# Altium project scope_pcb.PrjPcb
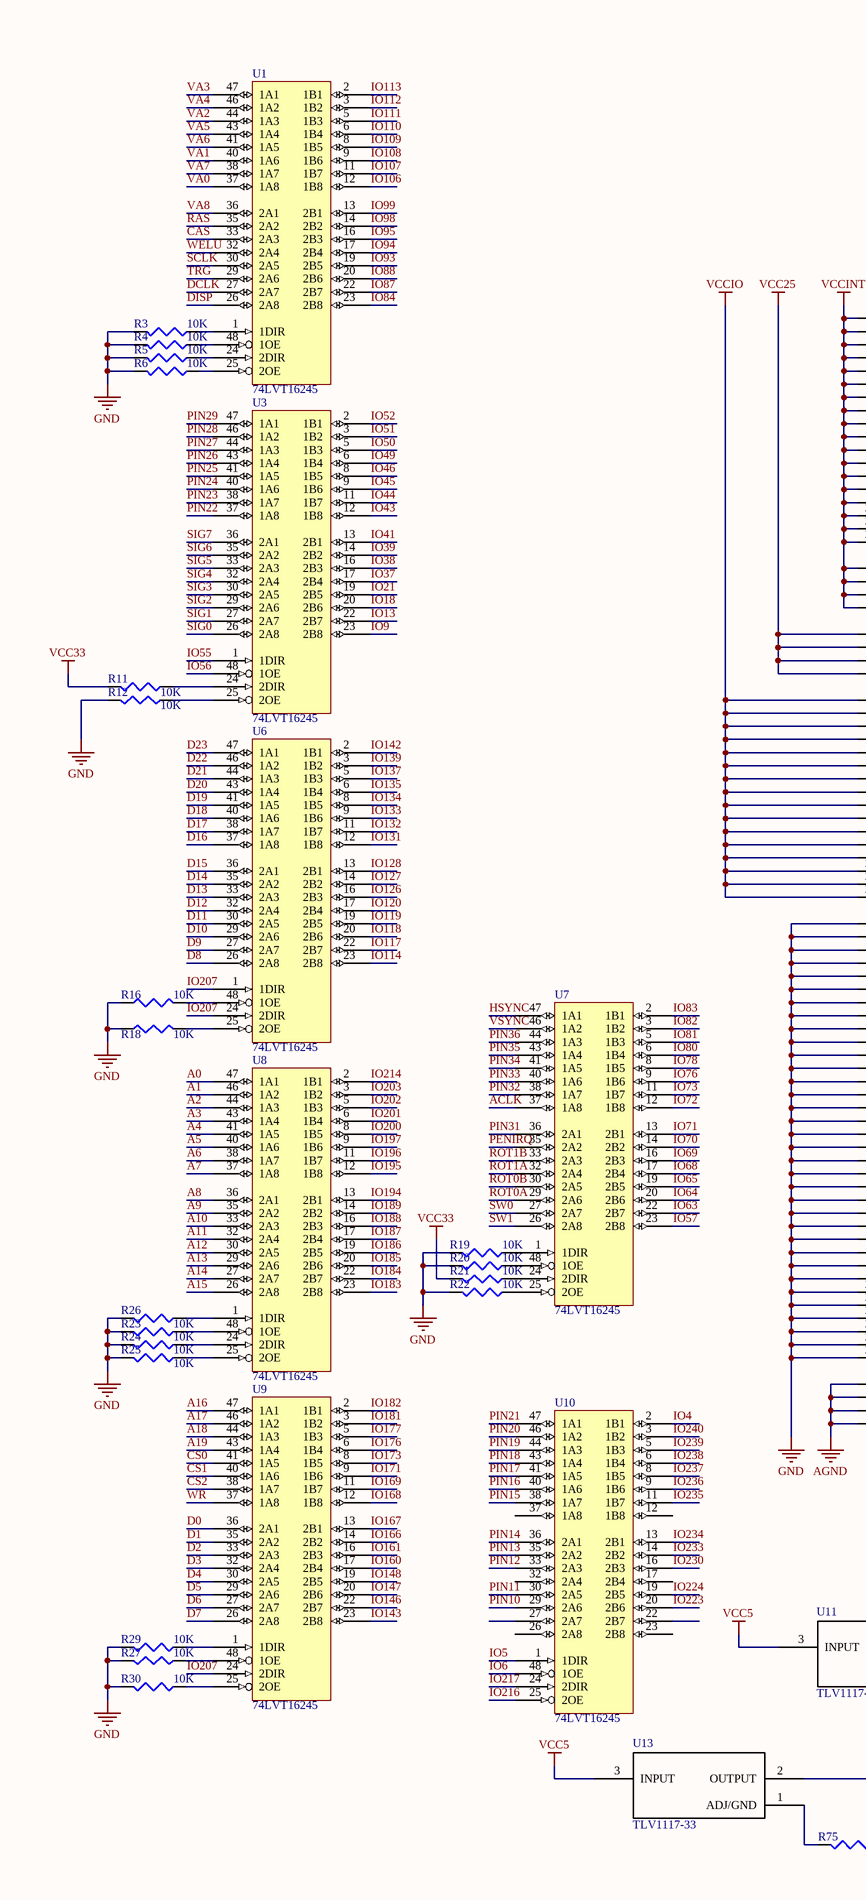
[diagram p0: fpga_sch.SchDoc, left]
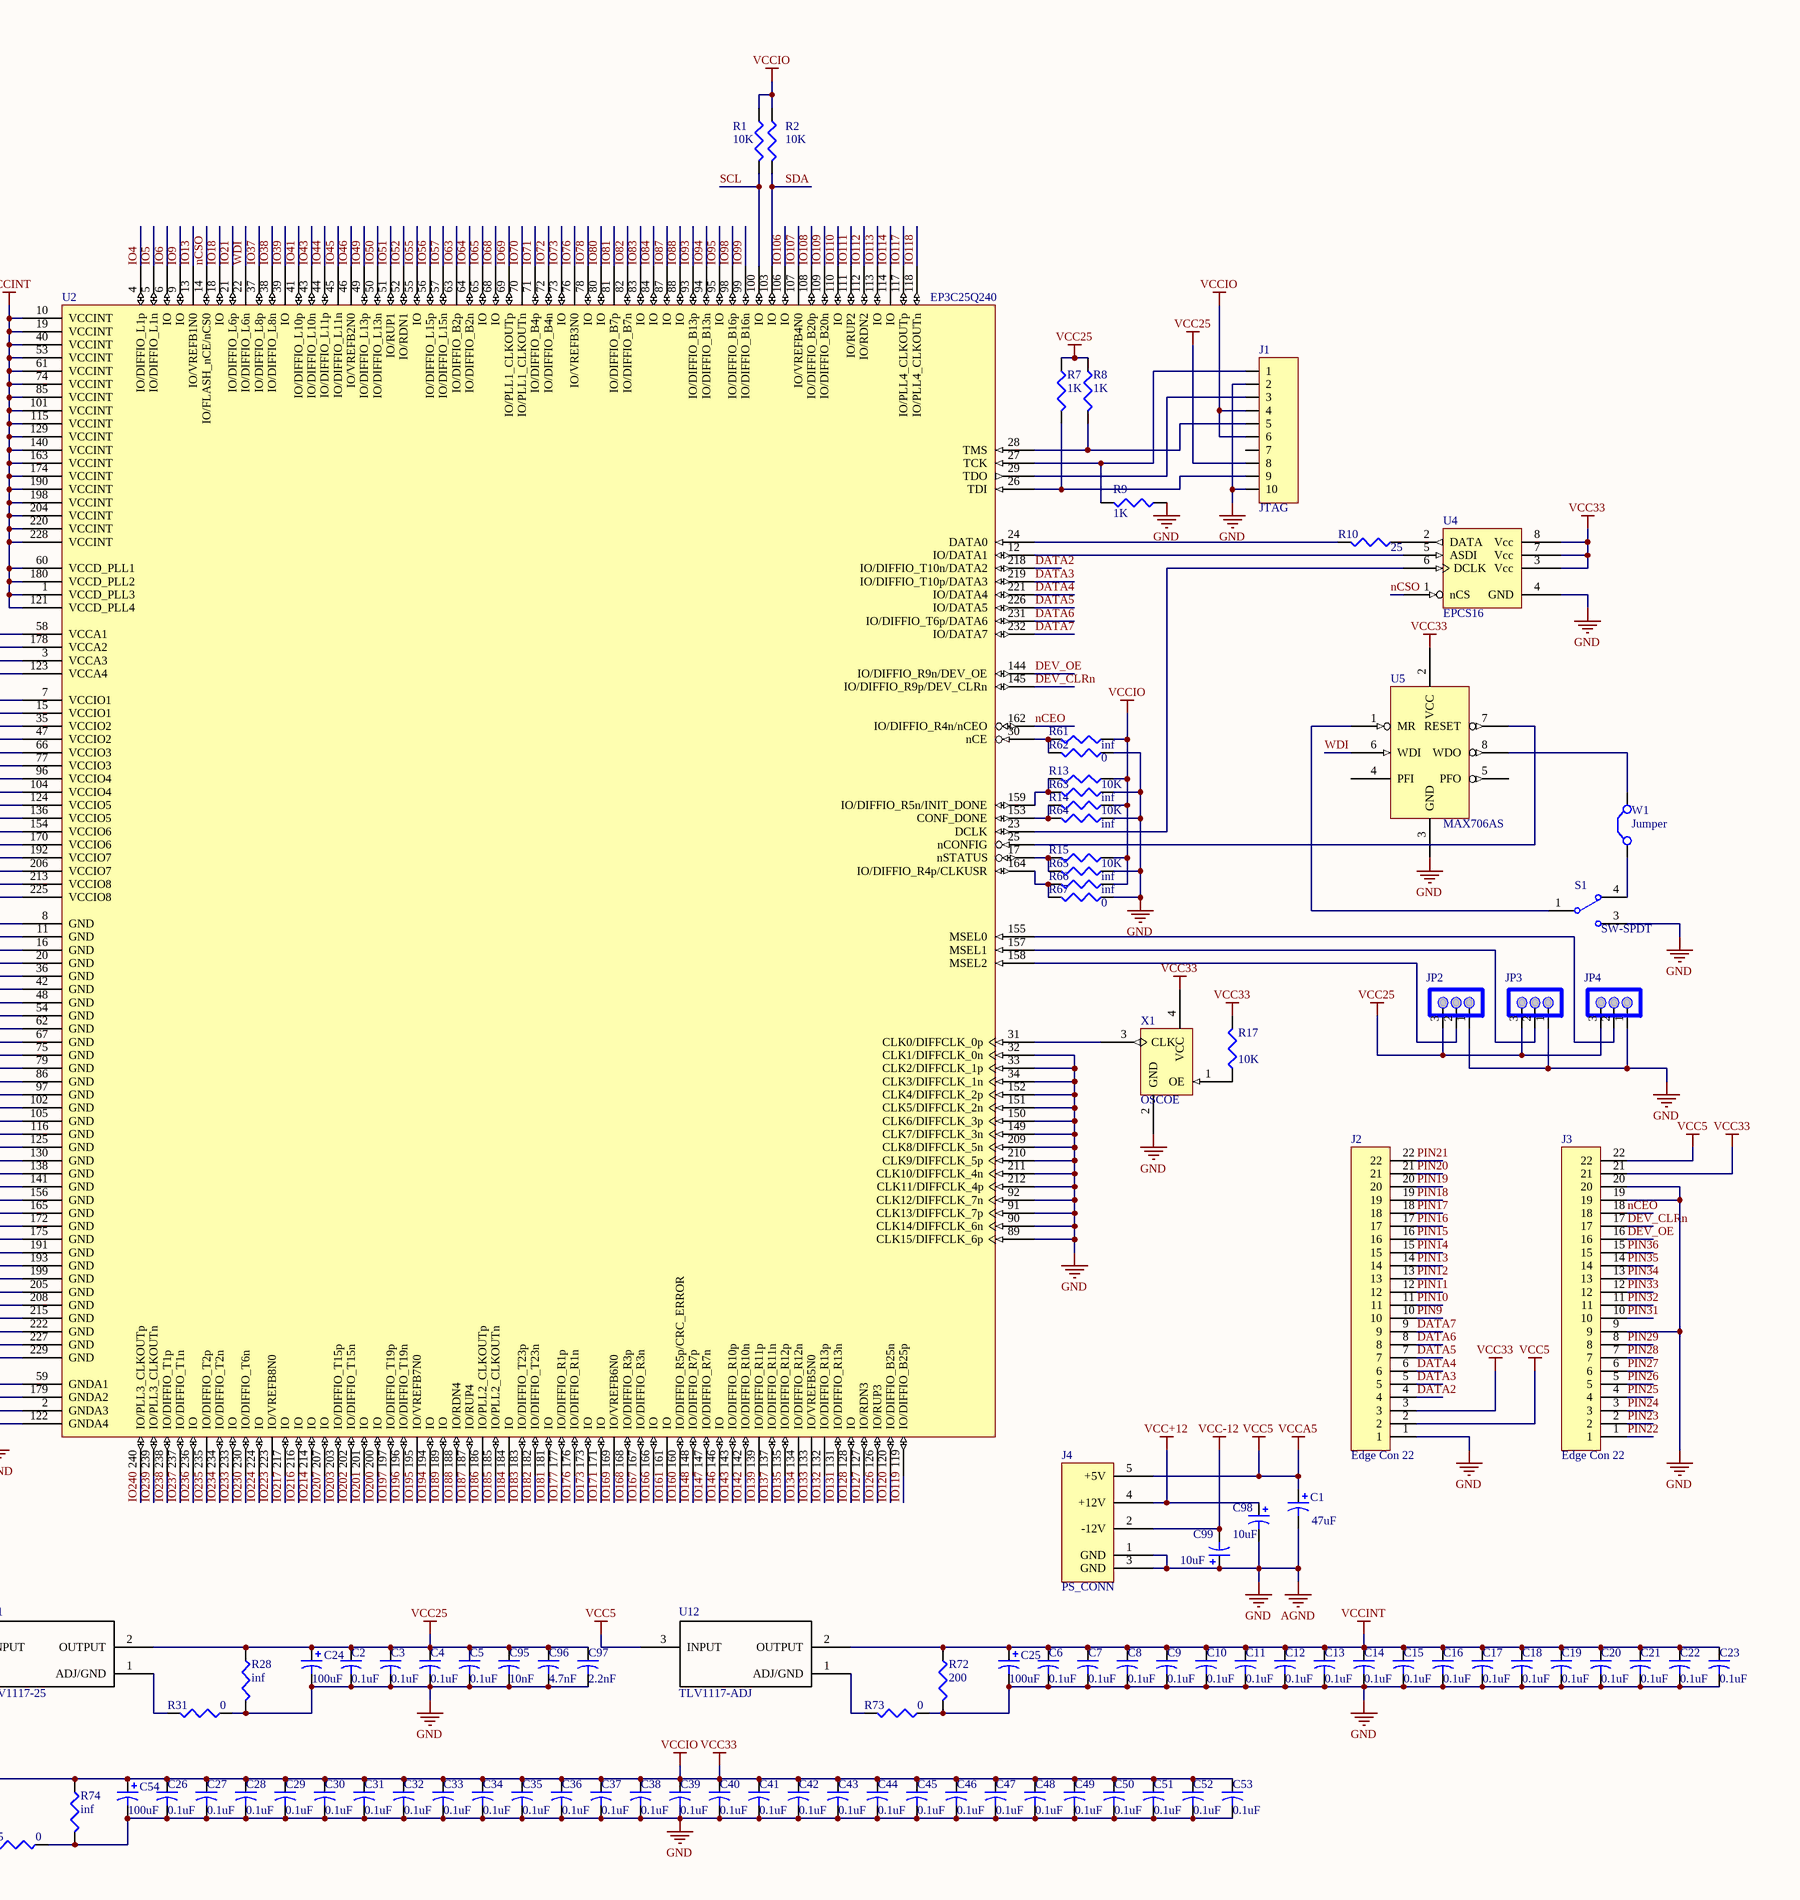
[diagram p1: fpga_sch.SchDoc, right]
5 sheets, 218 parts. Net scope: global (net labels, ports and power ports of the same name join across sheets).
Board file: SCOPE.PcbDoc
Sheets:
  fpga_sch.SchDoc
  sram_rom.SchDoc
  analog_frontend.SchDoc
  user_input.SchDoc
  vram.SchDoc

## Sheet fpga_sch.SchDoc: SoPC Oscilloscope - FPGA, Buffers
size C; Author: Santiago Navonne; DrawnBy: Santiago Navonne; Revision: 1.1; SheetNumber: 1; SheetTotal: 5

### Parts
C1  value 47uF  [CAPC3216N]  (hidden comment: Cap Pol1)
C2  value 0.1uF  [CAPC1608L]  (hidden comment: Cap2)
C3  value 0.1uF  [CAPC1608L]  (hidden comment: Cap2)
C4  value 0.1uF  [CAPC1608L]  (hidden comment: Cap2)
C5  value 0.1uF  [CAPC1608L]  (hidden comment: Cap2)
C6  value 0.1uF  [CAPC1608L]  (hidden comment: Cap2)
C7  value 0.1uF  [CAPC1608L]  (hidden comment: Cap2)
C8  value 0.1uF  [CAPC1608L]  (hidden comment: Cap2)
C9  value 0.1uF  [CAPC1608L]  (hidden comment: Cap2)
C10  value 0.1uF  [CAPC1608L]  (hidden comment: Cap2)
C11  value 0.1uF  [CAPC1608L]  (hidden comment: Cap2)
C12  value 0.1uF  [CAPC1608L]  (hidden comment: Cap2)
C13  value 0.1uF  [CAPC1608L]  (hidden comment: Cap2)
C14  value 0.1uF  [CAPC1608L]  (hidden comment: Cap2)
C15  value 0.1uF  [CAPC1608L]  (hidden comment: Cap2)
C16  value 0.1uF  [CAPC1608L]  (hidden comment: Cap2)
C17  value 0.1uF  [CAPC1608L]  (hidden comment: Cap2)
C18  value 0.1uF  [CAPC1608L]  (hidden comment: Cap2)
C19  value 0.1uF  [CAPC1608L]  (hidden comment: Cap2)
C20  value 0.1uF  [CAPC1608L]  (hidden comment: Cap2)
C21  value 0.1uF  [CAPC1608L]  (hidden comment: Cap2)
C22  value 0.1uF  [CAPC1608L]  (hidden comment: Cap2)
C23  value 0.1uF  [CAPC1608L]  (hidden comment: Cap2)
C24  value 100uF  [C2917]  (hidden comment: Cap Pol3)
C25  value 100uF  [C2917]  (hidden comment: Cap Pol3)
C26  value 0.1uF  [CAPC1608L]  (hidden comment: Cap2)
C27  value 0.1uF  [CAPC1608L]  (hidden comment: Cap2)
C28  value 0.1uF  [CAPC1608L]  (hidden comment: Cap2)
C29  value 0.1uF  [CAPC1608L]  (hidden comment: Cap2)
C30  value 0.1uF  [CAPC1608L]  (hidden comment: Cap2)
C31  value 0.1uF  [CAPC1608L]  (hidden comment: Cap2)
C32  value 0.1uF  [CAPC1608L]  (hidden comment: Cap2)
C33  value 0.1uF  [CAPC1608L]  (hidden comment: Cap2)
C34  value 0.1uF  [CAPC1608L]  (hidden comment: Cap2)
C35  value 0.1uF  [CAPC1608L]  (hidden comment: Cap2)
C36  value 0.1uF  [CAPC1608L]  (hidden comment: Cap2)
C37  value 0.1uF  [CAPC1608L]  (hidden comment: Cap2)
C38  value 0.1uF  [CAPC1608L]  (hidden comment: Cap2)
C39  value 0.1uF  [CAPC1608L]  (hidden comment: Cap2)
C40  value 0.1uF  [CAPC1608L]  (hidden comment: Cap2)
C41  value 0.1uF  [CAPC1608L]  (hidden comment: Cap2)
C42  value 0.1uF  [CAPC1608L]  (hidden comment: Cap2)
C43  value 0.1uF  [CAPC1608L]  (hidden comment: Cap2)
C44  value 0.1uF  [CAPC1608L]  (hidden comment: Cap2)
C45  value 0.1uF  [CAPC1608L]  (hidden comment: Cap2)
C46  value 0.1uF  [CAPC1608L]  (hidden comment: Cap2)
C47  value 0.1uF  [CAPC1608L]  (hidden comment: Cap2)
C48  value 0.1uF  [CAPC1608L]  (hidden comment: Cap2)
C49  value 0.1uF  [CAPC1608L]  (hidden comment: Cap2)
C50  value 0.1uF  [CAPC1608L]  (hidden comment: Cap2)
C51  value 0.1uF  [CAPC1608L]  (hidden comment: Cap2)
C52  value 0.1uF  [CAPC1608L]  (hidden comment: Cap2)
C53  value 0.1uF  [CAPC1608L]  (hidden comment: Cap2)
C54  value 100uF  [C2917]  (hidden comment: Cap Pol3)
C95  value 10nF  [CAPC1608L]  (hidden comment: Cap2)
C96  value 4.7nF  [CAPC1608L]  (hidden comment: Cap2)
C97  value 2.2nF  [CAPC1608L]  (hidden comment: Cap2)
C98  value 10uF  [CAPC3216N]  (hidden comment: Cap Pol1)
C99  value 10uF  [CAPC3216N]  (hidden comment: Cap Pol1)
J1  JTAG  [SIP2X5]
J2  Edge Con 22  [PIN22]
J3  Edge Con 22  [PIN22]
J4  PS_CONN  [DIN5]
JP2  MSEL2  [HDR1X3]  (value not drawn)
JP3  MSEL1  [HDR1X3]  (value not drawn)
JP4  MSEL0  [HDR1X3]  (value not drawn)
R1  value 10K  [RESC1608N]  (hidden comment: Res3)
R2  value 10K  [RESC1608N]  (hidden comment: Res3)
R3  value 10K  [RESC1608N]  (hidden comment: Res3)
R4  value 10K  [RESC1608N]  (hidden comment: Res3)
R5  value 10K  [RESC1608N]  (hidden comment: Res3)
R6  value 10K  [RESC1608N]  (hidden comment: Res3)
R7  value 1K  [RESC1608N]  (hidden comment: Res3)
R8  value 1K  [RESC1608N]  (hidden comment: Res3)
R9  value 1K  [RESC1608N]  (hidden comment: Res3)
R10  value 25  [RESC1608N]  (hidden comment: Res3)
R11  value 10K  [RESC1608N]  (hidden comment: Res3)
R12  value 10K  [RESC1608N]  (hidden comment: Res3)
R13  value 10K  [RESC1608N]  (hidden comment: Res3)
R14  value 10K  [RESC1608N]  (hidden comment: Res3)
R15  value 10K  [RESC1608N]  (hidden comment: Res3)
R16  value 10K  [RESC1608N]  (hidden comment: Res3)
R17  value 10K  [RESC1608N]  (hidden comment: Res3)
R18  value 10K  [RESC1608N]  (hidden comment: Res3)
R19  value 10K  [RESC1608N]  (hidden comment: Res3)
R20  value 10K  [RESC1608N]  (hidden comment: Res3)
R21  value 10K  [RESC1608N]  (hidden comment: Res3)
R22  value 10K  [RESC1608N]  (hidden comment: Res3)
R23  value 10K  [RESC1608N]  (hidden comment: Res3)
R24  value 10K  [RESC1608N]  (hidden comment: Res3)
R25  value 10K  [RESC1608N]  (hidden comment: Res3)
R26  value 10K  [RESC1608N]  (hidden comment: Res3)
R27  value 10K  [RESC1608N]  (hidden comment: Res3)
R28  value inf  [RESC1608N]  (hidden comment: Res3)
R29  value 10K  [RESC1608N]  (hidden comment: Res3)
R30  value 10K  [RESC1608N]  (hidden comment: Res3)
R31  value 0  [RESC1608N]  (hidden comment: Res3)
R61  value inf  [RESC1608N]  (hidden comment: Res3)
R62  value 0  [RESC1608N]  (hidden comment: Res3)
R63  value inf  [RESC1608N]  (hidden comment: Res3)
R64  value inf  [RESC1608N]  (hidden comment: Res3)
R65  value inf  [RESC1608N]  (hidden comment: Res3)
R66  value inf  [RESC1608N]  (hidden comment: Res3)
R67  value 0  [RESC1608N]  (hidden comment: Res3)
R72  value 200  [RESC1608N]  (hidden comment: Res3)
R73  value 0  [RESC1608N]  (hidden comment: Res3)
R74  value inf  [RESC1608N]  (hidden comment: Res3)
R75  value 0  [RESC1608N]  (hidden comment: Res3)
S1  SW-SPDT  [SPDT]
U1  74LVT16245  [TSSOP48]
U2  EP3C25Q240  [PQFP240]
U3  74LVT16245  [TSSOP48]
U4  EPCS16  [SO-8]
U5  MAX706AS  [DIP8]
U6  74LVT16245  [TSSOP48]
U7  74LVT16245  [TSSOP48]
U8  74LVT16245  [TSSOP48]
U9  74LVT16245  [TSSOP48]
U10  74LVT16245  [TSSOP48]
U11  TLV1117-25  [KVU3]
U12  TLV1117-ADJ  [KVU3]
U13  TLV1117-33  [KVU3]
W1  Jumper  [SIP2]
X1  OSCOE  [SG636PCE]

### Nets
AGND: C1.2 C2.2 C3.2 C4.2 C5.2 C6.2 C7.2 C8.2 C9.2 C10.2 C11.2 C12.2 C13.2 C14.2 C15.2 C16.2 C17.2 C18.2 C19.2 C20.2 C21.2 C22.2 C23.2 C24.2 C25.2 C26.2 C27.2 C28.2 C29.2 C30.2 C31.2 C32.2 C33.2 C34.2 C35.2 C36.2 C37.2 C38.2 C39.2 C40.2 C41.2 C42.2 C43.2 C44.2 C45.2 C46.2 C47.2 C48.2 C49.2 C50.2 C51.2 C52.2 C53.2 C54.2 C95.2 C96.2 C97.2 C98.2 C99.1 J1.2 J1.10 J2.1 J3.9 J3.19 J3.20 J4.1(GND) J4.3(GND) JP2.1(J1) JP3.1(J1) JP4.1(J1) R3.2 R4.2 R5.2 R6.2 R9.1 R12.2 R16.1 R18.1 R19.2 R20.2 R22.2 R23.2 R24.2 R25.2 R26.2 R27.2 R28.2 R29.2 R30.2 R31.1 R62.1 R63.1 R64.1 R65.1 R67.1 R72.2 R73.1 R74.2 R75.1 S1.3 U1.4(GND) U1.10(GND) U1.15(GND) U1.21(GND) U1.28(GND) U1.34(GND) U1.39(GND) U1.45(GND) U2.2(GNDA3) U2.8(GND) U2.11(GND) U2.16(GND) U2.20(GND) U2.32(CLK1/DIFFCLK_0n) U2.33(CLK2/DIFFCLK_1p) U2.34(CLK3/DIFFCLK_1n) U2.36(GND) U2.42(GND) U2.48(GND) U2.54(GND) U2.59(GNDA1) U2.62(GND) U2.67(GND) U2.75(GND) U2.79(GND) U2.86(GND) U2.89(CLK15/DIFFCLK_6p) U2.90(CLK14/DIFFCLK_6n) U2.91(CLK13/DIFFCLK_7p) U2.92(CLK12/DIFFCLK_7n) U2.97(GND) U2.102(GND) U2.105(GND) U2.116(GND) U2.122(GNDA4) U2.125(GND) U2.130(GND) U2.138(GND) U2.141(GND) U2.149(CLK7/DIFFCLK_3n) U2.150(CLK6/DIFFCLK_3p) U2.151(CLK5/DIFFCLK_2n) U2.152(CLK4/DIFFCLK_2p) U2.156(GND) U2.165(GND) U2.172(GND) U2.175(GND) U2.179(GNDA2) U2.191(GND) U2.193(GND) U2.199(GND) U2.205(GND) U2.208(GND) U2.209(CLK8/DIFFCLK_5n) U2.210(CLK9/DIFFCLK_5p) U2.211(CLK10/DIFFCLK_4n) U2.212(CLK11/DIFFCLK_4p) U2.215(GND) U2.222(GND) U2.227(GND) U2.229(GND) U3.4(GND) U3.10(GND) U3.15(GND) U3.21(GND) U3.28(GND) U3.34(GND) U3.39(GND) U3.45(GND) U4.4(GND) U5.3(GND) U6.4(GND) U6.10(GND) U6.15(GND) U6.21(GND) U6.28(GND) U6.34(GND) U6.39(GND) U6.45(GND) U7.4(GND) U7.10(GND) U7.15(GND) U7.21(GND) U7.28(GND) U7.34(GND) U7.39(GND) U7.45(GND) U8.4(GND) U8.10(GND) U8.15(GND) U8.21(GND) U8.28(GND) U8.34(GND) U8.39(GND) U8.45(GND) U9.4(GND) U9.10(GND) U9.15(GND) U9.21(GND) U9.28(GND) U9.34(GND) U9.39(GND) U9.45(GND) U10.4(GND) U10.10(GND) U10.15(GND) U10.21(GND) U10.28(GND) U10.34(GND) U10.39(GND) U10.45(GND) X1.2(GND)  [also labelled GND]
VCC: C1.1 C26.1 C27.1 C28.1 C29.1 C30.1 C31.1 C32.1 C33.1 C34.1 C35.1 C36.1 C37.1 C38.1 C39.1 C40.1 C41.1 C42.1 C43.1 C44.1 C45.1 C46.1 C47.1 C48.1 C49.1 C50.1 C51.1 C52.1 C53.1 C54.1 J1.4 J1.6 J2.2 J2.3 J3.21 J3.22 J4.5(+5V) R1.1 R2.1 R11.2 R13.1 R14.1 R15.1 R17.2 R21.2 R61.1 R66.1 R74.1 U1.7(Vcc33) U1.18(Vcc33) U1.31(Vcc33) U1.42(Vcc33) U2.7(VCCIO1) U2.15(VCCIO1) U2.35(VCCIO2) U2.47(VCCIO2) U2.66(VCCIO3) U2.77(VCCIO3) U2.96(VCCIO4) U2.104(VCCIO4) U2.124(VCCIO5) U2.136(VCCIO5) U2.154(VCCIO6) U2.170(VCCIO6) U2.192(VCCIO7) U2.206(VCCIO7) U2.213(VCCIO8) U2.225(VCCIO8) U3.7(Vcc33) U3.18(Vcc33) U3.31(Vcc33) U3.42(Vcc33) U4.3(Vcc) U4.7(Vcc) U4.8(Vcc) U5.2(VCC) U6.7(Vcc33) U6.18(Vcc33) U6.31(Vcc33) U6.42(Vcc33) U7.7(Vcc33) U7.18(Vcc33) U7.31(Vcc33) U7.42(Vcc33) U8.7(Vcc33) U8.18(Vcc33) U8.31(Vcc33) U8.42(Vcc33) U9.7(Vcc33) U9.18(Vcc33) U9.31(Vcc33) U9.42(Vcc33) U10.7(Vcc33) U10.18(Vcc33) U10.31(Vcc33) U10.42(Vcc33) U11.3(INPUT) U12.3(INPUT) U13.2(OUTPUT) U13.3(INPUT) X1.4(VCC)  [also labelled VCC33, VCC5, VCCA5, VCCIO]
VCC25: C2.1 C3.1 C4.1 C5.1 C24.1 C95.1 C96.1 C97.1 J1.8 JP2.3(J3) JP3.3(J3) JP4.3(J3) R7.1 R8.1 R28.1 U2.3(VCCA3) U2.58(VCCA1) U2.123(VCCA4) U2.178(VCCA2) U11.2(OUTPUT)
VCC+12: C98.1 J4.4(+12V)
VCC-12: C99.2 J4.2(-12V)
VCCINT: C6.1 C7.1 C8.1 C9.1 C10.1 C11.1 C12.1 C13.1 C14.1 C15.1 C16.1 C17.1 C18.1 C19.1 C20.1 C21.1 C22.1 C23.1 C25.1 R72.1 U2.1(VCCD_PLL3) U2.10(VCCINT) U2.19(VCCINT) U2.40(VCCINT) U2.53(VCCINT) U2.60(VCCD_PLL1) U2.61(VCCINT) U2.74(VCCINT) U2.85(VCCINT) U2.101(VCCINT) U2.115(VCCINT) U2.121(VCCD_PLL4) U2.129(VCCINT) U2.140(VCCINT) U2.163(VCCINT) U2.174(VCCINT) U2.180(VCCD_PLL2) U2.190(VCCINT) U2.198(VCCINT) U2.204(VCCINT) U2.220(VCCINT) U2.228(VCCINT) U12.2(OUTPUT)
A0: U8.47(1A1)
A1: U8.46(1A2)
A2: U8.44(1A3)
A3: U8.43(1A4)
A4: U8.41(1A5)
A5: U8.40(1A6)
A6: U8.38(1A7)
A7: U8.37(1A8)
A8: U8.36(2A1)
A9: U8.35(2A2)
A10: U8.33(2A3)
A11: U8.32(2A4)
A12: U8.30(2A5)
A13: U8.29(2A6)
A14: U8.27(2A7)
A15: U8.26(2A8)
A16: U9.47(1A1)
A17: U9.46(1A2)
A18: U9.44(1A3)
A19: U9.43(1A4)
ACLK: U7.37(1A8)
CAS: U1.33(2A3)
CS0: U9.41(1A5)
CS1: U9.40(1A6)
CS2: U9.38(1A7)
D0: U9.36(2A1)
D1: U9.35(2A2)
D2: U9.33(2A3)
D3: U9.32(2A4)
D4: U9.30(2A5)
D5: U9.29(2A6)
D6: U9.27(2A7)
D7: U9.26(2A8)
D8: U6.26(2A8)
D9: U6.27(2A7)
D10: U6.29(2A6)
D11: U6.30(2A5)
D12: U6.32(2A4)
D13: U6.33(2A3)
D14: U6.35(2A2)
D15: U6.36(2A1)
D16: U6.37(1A8)
D17: U6.38(1A7)
D18: U6.40(1A6)
D19: U6.41(1A5)
D20: U6.43(1A4)
D21: U6.44(1A3)
D22: U6.46(1A2)
D23: U6.47(1A1)
DATA2: J2.4 U2.218(IO/DIFFIO_T10n/DATA2)
DATA3: J2.5 U2.219(IO/DIFFIO_T10p/DATA3)
DATA4: J2.6 U2.221(IO/DATA4)
DATA5: J2.7 U2.226(IO/DATA5)
DATA6: J2.8 U2.231(IO/DIFFIO_T6p/DATA6)
DATA7: J2.9 U2.232(IO/DATA7)
DCLK: U1.27(2A7)
DEV_CLRn: J3.17 U2.145(IO/DIFFIO_R9p/DEV_CLRn)
DEV_OE: J3.16 U2.144(IO/DIFFIO_R9n/DEV_OE)
DISP: U1.26(2A8)
HSYNC: U7.47(1A1)
IO4: U2.4(IO/DIFFIO_L1p) U10.2(1B1)
IO5: U2.5(IO/DIFFIO_L1n) U10.1(1DIR)
IO6: U2.6(IO) U10.48(1OE)
IO9: U2.9(IO) U3.23(2B8)
IO13: U2.13(IO/VREFB1N0) U3.22(2B7)
IO18: U2.18(IO) U3.20(2B6)
IO21: U2.21(IO/DIFFIO_L6p) U3.19(2B5)
IO37: U2.37(IO/DIFFIO_L8p) U3.17(2B4)
IO38: U2.38(IO/DIFFIO_L8n) U3.16(2B3)
IO39: U2.39(IO) U3.14(2B2)
IO41: U2.41(IO/DIFFIO_L10p) U3.13(2B1)
IO43: U2.43(IO/DIFFIO_L10n) U3.12(1B8)
IO44: U2.44(IO/DIFFIO_L11p) U3.11(1B7)
IO45: U2.45(IO/DIFFIO_L11n) U3.9(1B6)
IO46: U2.46(IO/VREFB2N0) U3.8(1B5)
IO49: U2.49(IO/DIFFIO_L13p) U3.6(1B4)
IO50: U2.50(IO/DIFFIO_L13n) U3.5(1B3)
IO51: U2.51(IO/RUP1) U3.3(1B2)
IO52: U2.52(IO/RDN1) U3.2(1B1)
IO55: U2.55(IO) U3.1(1DIR)
IO56: U2.56(IO/DIFFIO_L15p) U3.48(1OE)
IO57: U2.57(IO/DIFFIO_L15n) U7.23(2B8)
IO63: U2.63(IO/DIFFIO_B2p) U7.22(2B7)
IO64: U2.64(IO/DIFFIO_B2n) U7.20(2B6)
IO65: U2.65(IO) U7.19(2B5)
IO68: U2.68(IO) U7.17(2B4)
IO69: U2.69(IO/PLL1_CLKOUTp) U7.16(2B3)
IO70: U2.70(IO/PLL1_CLKOUTn) U7.14(2B2)
IO71: U2.71(IO/DIFFIO_B4p) U7.13(2B1)
IO72: U2.72(IO/DIFFIO_B4n) U7.12(1B8)
IO73: U2.73(IO) U7.11(1B7)
IO76: U2.76(IO/VREFB3N0) U7.9(1B6)
IO78: U2.78(IO) U7.8(1B5)
IO80: U2.80(IO) U7.6(1B4)
IO81: U2.81(IO/DIFFIO_B7p) U7.5(1B3)
IO82: U2.82(IO/DIFFIO_B7n) U7.3(1B2)
IO83: U2.83(IO) U7.2(1B1)
IO84: U1.23(2B8) U2.84(IO)
IO87: U1.22(2B7) U2.87(IO)
IO88: U1.20(2B6) U2.88(IO)
IO93: U1.19(2B5) U2.93(IO/DIFFIO_B13p)
IO94: U1.17(2B4) U2.94(IO/DIFFIO_B13n)
IO95: U1.16(2B3) U2.95(IO)
IO98: U1.14(2B2) U2.98(IO/DIFFIO_B16p)
IO99: U1.13(2B1) U2.99(IO/DIFFIO_B16n)
IO106: U1.12(1B8) U2.106(IO)
IO107: U1.11(1B7) U2.107(IO/VREFB4N0)
IO108: U1.9(1B6) U2.108(IO/DIFFIO_B20p)
IO109: U1.8(1B5) U2.109(IO/DIFFIO_B20n)
IO110: U1.6(1B4) U2.110(IO)
IO111: U1.5(1B3) U2.111(IO/RUP2)
IO112: U1.3(1B2) U2.112(IO/RDN2)
IO113: U1.2(1B1) U2.113(IO)
IO114: U2.114(IO) U6.23(2B8)
IO117: U2.117(IO/PLL4_CLKOUTp) U6.22(2B7)
IO118: U2.118(IO/PLL4_CLKOUTn) U6.20(2B6)
IO119: U2.119(IO/DIFFIO_B25p) U6.19(2B5)
IO120: U2.120(IO/DIFFIO_B25n) U6.17(2B4)
IO126: U2.126(IO/RUP3) U6.16(2B3)
IO127: U2.127(IO/RDN3) U6.14(2B2)
IO128: U2.128(IO) U6.13(2B1)
IO131: U2.131(IO/DIFFIO_R13n) U6.12(1B8)
IO132: U2.132(IO/DIFFIO_R13p) U6.11(1B7)
IO133: U2.133(IO/VREFB5N0) U6.9(1B6)
IO134: U2.134(IO/DIFFIO_R12n) U6.8(1B5)
IO135: U2.135(IO/DIFFIO_R12p) U6.6(1B4)
IO137: U2.137(IO/DIFFIO_R11n) U6.5(1B3)
IO139: U2.139(IO/DIFFIO_R11p) U6.3(1B2)
IO142: U2.142(IO/DIFFIO_R10n) U6.2(1B1)
IO143: U2.143(IO/DIFFIO_R10p) U9.23(2B8)
IO146: U2.146(IO) U9.22(2B7)
IO147: U2.147(IO/DIFFIO_R7n) U9.20(2B6)
IO148: U2.148(IO/DIFFIO_R7p) U9.19(2B5)
IO160: U2.160(IO/DIFFIO_R5p/CRC_ERROR) U9.17(2B4)
IO161: U2.161(IO) U9.16(2B3)
IO166: U2.166(IO) U9.14(2B2)
IO167: U2.167(IO/DIFFIO_R3n) U9.13(2B1)
IO168: U2.168(IO/DIFFIO_R3p) U9.12(1B8)
IO169: U2.169(IO/VREFB6N0) U9.11(1B7)
IO171: U2.171(IO) U9.9(1B6)
IO173: U2.173(IO) U9.8(1B5)
IO176: U2.176(IO/DIFFIO_R1n) U9.6(1B4)
IO177: U2.177(IO/DIFFIO_R1p) U9.5(1B3)
IO181: U2.181(IO) U9.3(1B2)
IO182: U2.182(IO/DIFFIO_T23n) U9.2(1B1)
IO183: U2.183(IO/DIFFIO_T23p) U8.23(2B8)
IO184: U2.184(IO) U8.22(2B7)
IO185: U2.185(IO/PLL2_CLKOUTn) U8.20(2B6)
IO186: U2.186(IO/PLL2_CLKOUTp) U8.19(2B5)
IO187: U2.187(IO/RUP4) U8.17(2B4)
IO188: U2.188(IO/RDN4) U8.16(2B3)
IO189: U2.189(IO) U8.14(2B2)
IO194: U2.194(IO) U8.13(2B1)
IO195: U2.195(IO/VREFB7N0) U8.12(1B8)
IO196: U2.196(IO/DIFFIO_T19n) U8.11(1B7)
IO197: U2.197(IO/DIFFIO_T19p) U8.9(1B6)
IO200: U2.200(IO) U8.8(1B5)
IO201: U2.201(IO) U8.6(1B4)
IO202: U2.202(IO/DIFFIO_T15n) U8.5(1B3)
IO203: U2.203(IO/DIFFIO_T15p) U8.3(1B2)
IO207: U2.207(IO) U6.1(1DIR) U6.24(2DIR) U9.24(2DIR)
IO214: U2.214(IO) U8.2(1B1)
IO216: U2.216(IO) U10.25(2OE)
IO217: U2.217(IO) U10.24(2DIR)
IO223: U2.223(IO/VREFB8N0) U10.20(2B6)
IO224: U2.224(IO) U10.19(2B5)
IO230: U2.230(IO/DIFFIO_T6n) U10.16(2B3)
IO233: U2.233(IO) U10.14(2B2)
IO234: U2.234(IO/DIFFIO_T2n) U10.13(2B1)
IO235: U2.235(IO/DIFFIO_T2p) U10.11(1B7)
IO236: U2.236(IO) U10.9(1B6)
IO237: U2.237(IO/DIFFIO_T1n) U10.8(1B5)
IO238: U2.238(IO/DIFFIO_T1p) U10.6(1B4)
IO239: U2.239(IO/PLL3_CLKOUTn) U10.5(1B3)
IO240: U2.240(IO/PLL3_CLKOUTp) U10.3(1B2)
nCEO: J3.18 U2.162(IO/DIFFIO_R4n/nCEO)
nCSO: U2.14(IO/FLASH_nCE/nCS0) U4.1(nCS)
PENIRQ: U7.35(2A2)
PIN9: J2.10
PIN10: J2.11 U10.29(2A6)
PIN11: J2.12 U10.30(2A5)
PIN12: J2.13 U10.33(2A3)
PIN13: J2.14 U10.35(2A2)
PIN14: J2.15 U10.36(2A1)
PIN15: J2.16 U10.38(1A7)
PIN16: J2.17 U10.40(1A6)
PIN17: J2.18 U10.41(1A5)
PIN18: J2.19 U10.43(1A4)
PIN19: J2.20 U10.44(1A3)
PIN20: J2.21 U10.46(1A2)
PIN21: J2.22 U10.47(1A1)
PIN22: J3.1 U3.37(1A8)
PIN23: J3.2 U3.38(1A7)
PIN24: J3.3 U3.40(1A6)
PIN25: J3.4 U3.41(1A5)
PIN26: J3.5 U3.43(1A4)
PIN27: J3.6 U3.44(1A3)
PIN28: J3.7 U3.46(1A2)
PIN29: J3.8 U3.47(1A1)
PIN31: J3.10 U7.36(2A1)
PIN32: J3.11 U7.38(1A7)
PIN33: J3.12 U7.40(1A6)
PIN34: J3.13 U7.41(1A5)
PIN35: J3.14 U7.43(1A4)
PIN36: J3.15 U7.44(1A3)
RAS: U1.35(2A2)
ROT0A: U7.29(2A6)
ROT0B: U7.30(2A5)
ROT1A: U7.32(2A4)
ROT1B: U7.33(2A3)
SCL: R1.2 U2.100(IO)
SCLK: U1.30(2A5)
SDA: R2.2 U2.103(IO)
SIG0: U3.26(2A8)
SIG1: U3.27(2A7)
SIG2: U3.29(2A6)
SIG3: U3.30(2A5)
SIG4: U3.32(2A4)
SIG5: U3.33(2A3)
SIG6: U3.35(2A2)
SIG7: U3.36(2A1)
SW0: U7.27(2A7)
SW1: U7.26(2A8)
TRG: U1.29(2A6)
VA0: U1.37(1A8)
VA1: U1.40(1A6)
VA2: U1.44(1A3)
VA3: U1.47(1A1)
VA4: U1.46(1A2)
VA5: U1.43(1A4)
VA6: U1.41(1A5)
VA7: U1.38(1A7)
VA8: U1.36(2A1)
VSYNC: U7.46(1A2)
WDI: U2.22(IO/DIFFIO_L6n) U5.6(WDI)
WELU: U1.32(2A4)
WR: U9.37(1A8)
NetJ1_1: J1.1 R9.2 U2.27(TCK)
NetJ1_3: J1.3 U2.29(TDO)
NetJ1_5: J1.5 R8.2 U2.28(TMS)
NetJ1_9: J1.9 R7.2 U2.26(TDI)
NetJP2_2: JP2.2(J2) U2.158(MSEL2)
NetJP3_2: JP3.2(J2) U2.157(MSEL1)
NetJP4_2: JP4.2(J2) U2.155(MSEL0)
NetR3_1: R3.1 U1.1(1DIR)
NetR4_1: R4.1 U1.48(1OE)
NetR5_1: R5.1 U1.24(2DIR)
NetR6_1: R6.1 U1.25(2OE)
NetR10_1: R10.1 U4.2(DATA)
NetR10_2: R10.2 U2.24(DATA0)
NetR11_1: R11.1 U3.24(2DIR)
NetR12_1: R12.1 U3.25(2OE)
NetR13_2: R13.2 R63.2 U2.159(IO/DIFFIO_R5n/INIT_DONE)
NetR14_2: R14.2 R64.2 U2.153(CONF_DONE)
NetR15_2: R15.2 R65.2 U2.17(nSTATUS)
NetR16_2: R16.2 U6.48(1OE)
NetR17_1: R17.1 X1.1(OE)
NetR18_2: R18.2 U6.25(2OE)
NetR19_1: R19.1 U7.1(1DIR)
NetR20_1: R20.1 U7.48(1OE)
NetR21_1: R21.1 U7.24(2DIR)
NetR22_1: R22.1 U7.25(2OE)
NetR23_1: R23.1 U8.48(1OE)
NetR24_1: R24.1 U8.24(2DIR)
NetR25_1: R25.1 U8.25(2OE)
NetR26_1: R26.1 U8.1(1DIR)
NetR27_1: R27.1 U9.48(1OE)
NetR29_1: R29.1 U9.1(1DIR)
NetR30_1: R30.1 U9.25(2OE)
NetR31_2: R31.2 U11.1(ADJ/GND)
NetR61_2: R61.2 R62.2 U2.30(nCE)
NetR66_2: R66.2 R67.2 U2.164(IO/DIFFIO_R4p/CLKUSR)
NetR73_2: R73.2 U12.1(ADJ/GND)
NetR75_2: R75.2 U13.1(ADJ/GND)
NetS1_1: S1.1 U5.1(MR)
NetS1_4: S1.4 W1.1(C1)
NetU2_12: U2.12(IO/DATA1) U4.5(ASDI)
NetU2_23: U2.23(DCLK) U4.6(DCLK)
NetU2_25: U2.25(nCONFIG) U5.7(RESET)
NetU2_31: U2.31(CLK0/DIFFCLK_0p) X1.3(CLK)
NetU5_8: U5.8(WDO) W1.2(C2)

Not connected (* = marked no-connect by the designer): J1 7; U5 4(PFI) 5(PFO); U10 12(1B8) 17(2B4) 22(2B7) 23(2B8) 26(2A8) 27(2A7) 32(2A4) 37(1A8)

### Library data of the parts
C1 C98 C99 = Cap Pol1: Polarized Capacitor; Published: 8-Jun-2000; LatestRevisionDate: 17-Jul-2002; LatestRevisionNote: Re-released for DXP Platform.; PackageReference: RB7.6-15; Publisher: Altium Limited; PackageDescription: Polarized Capacitor (Radial); 2 Leads
C2-C23 C26-C53 C95-C97 = Cap2: Capacitor; Published: 23-Sep-2002; PackageReference: CAPR5-4X5; Publisher: Altium Limited; PackageDescription: Capacitor; 2 Leads
C24 C25 C54 = Cap Pol3: Polarized Capacitor (Surface Mount); Published: 8-Jun-2000; LatestRevisionDate: 29-May-2009; LatestRevisionNote: IPC-7351 Footprint Added.; PackageReference: C0805; Publisher: Altium Limited; PackageDescription: Chip Capacitor
J1 = CON10
J2 J3 = Edge Con 22: 22-Pin Edge Connector; LatestRevisionDate: 17-Jul-2002; LatestRevisionNote: Re-released for DXP Platform.; Publisher: Altium Limited
J4 = PS_CONN: Elpac Compatible Power Supply Connector
JP2-JP4 = JUMPER3SM
R1-R31 R61-R67 R72-R75 = Res3: Resistor; Published: 8-Jun-2000; LatestRevisionDate: 29-May-2009; LatestRevisionNote: IPC-7351 Footprint Added.; PackageReference: J1-0603; Publisher: Altium Limited; PackageDescription: Chip Resistor
S1 = SW-SPDT: SPDT Subminiature Toggle Switch, Right Angle Mounting, Vertical Actuation; Published: 24-Mar-1999; LatestRevisionDate: 17-Dec-2003; LatestRevisionNote: Schematic revised, PCB Footprint replaced.; PackageReference: TL36WW15050; Publisher: Altium Limited; PackageDescription: Switch; 4 Leads; DatasheetVersion: 05-Dec-2000; ComponentLink1Description: Manufacturer Link; ComponentLink1URL: http://www.apem.com
U1 U3 U6-U10 = 74LVT16245: 16-Bit Bus Transceiver
U2 = EP3C25Q240: Cyclone III EP3C-25 FPGA PQFP240
U4 = EPCS1: Altera Serial Configuration Device
U5 = MAX705: Maxim uP Supervisory Circuit
U11 = TLV1117-25_KVU_3: Imported; Vendor: Texas Instruments; PACKAGE_DESIGNATOR: KVU; PIN_COUNT: 3; FAMILY_NAME: STANDARD VOLTAGE REGULATOR; INDUSTRY_STD_PKG_TYPE: PFM; Manufacturer_Part_Number: tlv1117-25_kvu_3; GENERIC_PART_NUMBER: TLV1117-25; Datasheet URL: http://www.ti.com/lit/gpn/TLV1117-25; Manufacturer: Texas Instruments; RefDes: RefDes; Type: DEV; Value: Value
U12 = TLV1117_KCS_3: Imported; Vendor: Texas Instruments; PACKAGE_DESIGNATOR: KCS; PIN_COUNT: 3; FAMILY_NAME: STANDARD VOLTAGE REGULATOR; INDUSTRY_STD_PKG_TYPE: TO-220; Manufacturer_Part_Number: tlv1117_kcs_3; GENERIC_PART_NUMBER: TLV1117; Datasheet URL: http://www.ti.com/lit/gpn/TLV1117; Manufacturer: Texas Instruments; RefDes: RefDes; Type: DEV; Value: Value
U13 = TLV1117-33_KVU_3: Imported; Vendor: Texas Instruments; PACKAGE_DESIGNATOR: KVU; PIN_COUNT: 3; FAMILY_NAME: STANDARD VOLTAGE REGULATOR; INDUSTRY_STD_PKG_TYPE: PFM; Manufacturer_Part_Number: tlv1117-33_kvu_3; GENERIC_PART_NUMBER: TLV1117-33; Datasheet URL: http://www.ti.com/lit/gpn/TLV1117-33; Manufacturer: Texas Instruments; RefDes: RefDes; Type: DEV; Value: Value
W1 = Jumper: Jumper Wire; Published: 24-Mar-1999; LatestRevisionDate: 17-Jul-2002; LatestRevisionNote: Re-released for DXP Platform.; PackageReference: RAD-0.2; Publisher: Altium Limited; PackageDescription: Radial Cap, Thru-Hole; 2 Leads; 0.2 in Pin Spacing
X1 = OSCOE: Oscillator with Active High Output Enable

## Sheet sram_rom.SchDoc: SoPC Oscilloscope - SRAM, ROM
size A; DrawnBy: Santiago Navonne; Revision: 1.0; SheetNumber: 2; SheetTotal: 5
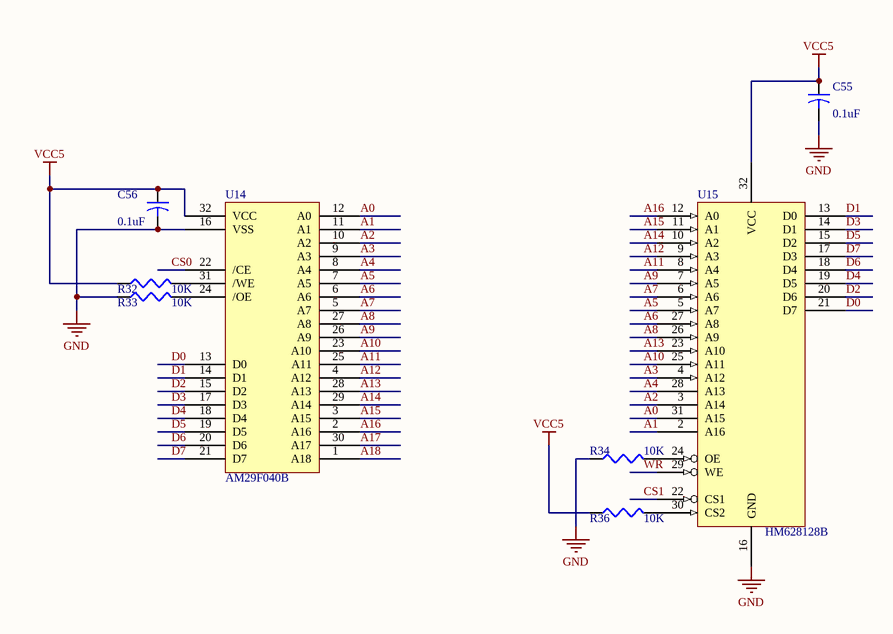
[diagram p2: sram_rom.SchDoc]

### Parts
C55  value 0.1uF  [CAPC1608L]  (hidden comment: Cap2)
C56  value 0.1uF  [CAPC1608L]  (hidden comment: Cap2)
R32  value 10K  [RESC1608N]  (hidden comment: Res3)
R33  value 10K  [RESC1608N]  (hidden comment: Res3)
R34  value 10K  [RESC1608N]  (hidden comment: Res3)
R36  value 10K  [RESC1608N]  (hidden comment: Res3)
U14  AM29F040B  [PLCCS32]
U15  HM628128B  [DIP32]

### Nets
GND: C55.2 C56.2 R33.1 R34.1 U14.16(VSS) U15.16(GND)  [project net AGND]
VCC: C55.1 C56.1 R32.1 R36.1 U14.32(VCC) U15.32(VCC)  [also labelled VCC5]
A0: U14.12(A0) U15.31(A15)
A1: U14.11(A1) U15.2(A16)
A2: U14.10(A2) U15.3(A14)
A3: U14.9(A3) U15.4(A12)
A4: U14.8(A4) U15.28(A13)
A5: U14.7(A5) U15.5(A7)
A6: U14.6(A6) U15.27(A8)
A7: U14.5(A7) U15.6(A6)
A8: U14.27(A8) U15.26(A9)
A9: U14.26(A9) U15.7(A5)
A10: U14.23(A10) U15.25(A11)
A11: U14.25(A11) U15.8(A4)
A12: U14.4(A12) U15.9(A3)
A13: U14.28(A13) U15.23(A10)
A14: U14.29(A14) U15.10(A2)
A15: U14.3(A15) U15.11(A1)
A16: U14.2(A16) U15.12(A0)
A17: U14.30(A17)
A18: U14.1(A18)
CS0: U14.22(/CE)
CS1: U15.22(CS1)
D0: U14.13(D0) U15.21(D7)
D1: U14.14(D1) U15.13(D0)
D2: U14.15(D2) U15.20(D6)
D3: U14.17(D3) U15.14(D1)
D4: U14.18(D4) U15.19(D5)
D5: U14.19(D5) U15.15(D2)
D6: U14.20(D6) U15.18(D4)
D7: U14.21(D7) U15.17(D3)
WR: U15.29(WE)
NetR32_2: R32.2 U14.31(/WE)
NetR33_2: R33.2 U14.24(/OE)
NetR34_2: R34.2 U15.24(OE)
NetR36_2: R36.2 U15.30(CS2)

### Library data of the parts
C55 C56 = Cap2: Capacitor; Published: 23-Sep-2002; PackageReference: CAPR5-4X5; Publisher: Altium Limited; PackageDescription: Capacitor; 2 Leads
R32-R34 R36 = Res3: Resistor; Published: 8-Jun-2000; LatestRevisionDate: 29-May-2009; LatestRevisionNote: IPC-7351 Footprint Added.; PackageReference: J1-0603; Publisher: Altium Limited; PackageDescription: Chip Resistor
U14 = AM29F040B: 512KBit x 8 ROM
U15 = HM628128B: 1 M SRAM (128-kword x 8-bit)

## Sheet analog_frontend.SchDoc: SoPC Oscilloscope - Analog Interface
size A; DrawnBy: Santiago Navonne; Revision: 1.1; SheetNumber: 3; SheetTotal: 5
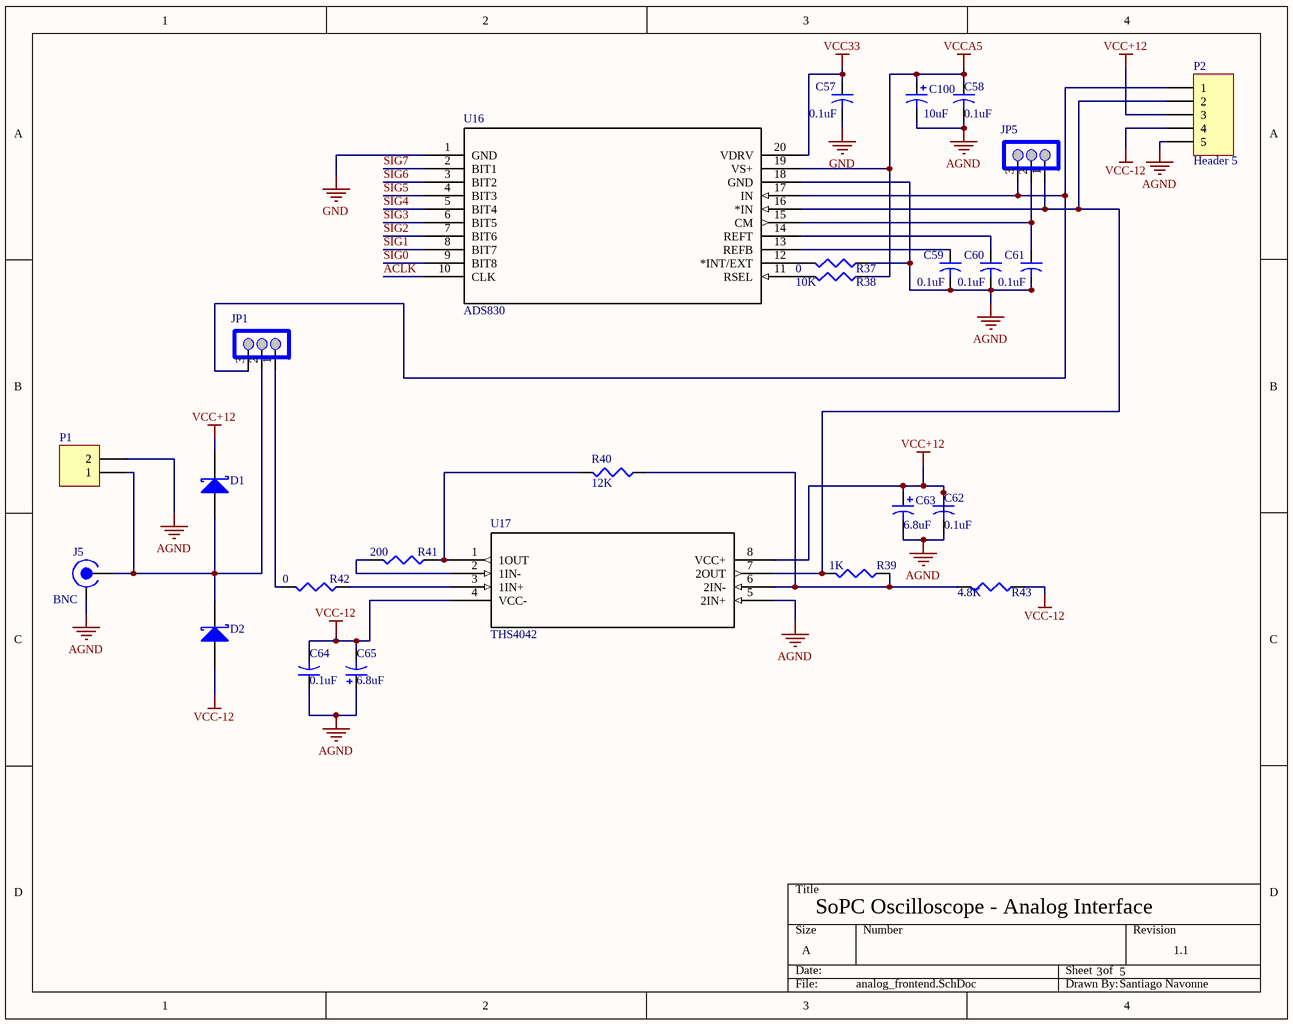
[diagram p3: analog_frontend.SchDoc]

### Parts
C57  value 0.1uF  [CAPC1608L]  (hidden comment: Cap2)
C58  value 0.1uF  [CAPC1608L]  (hidden comment: Cap2)
C59  value 0.1uF  [CAPC1608L]  (hidden comment: Cap2)
C60  value 0.1uF  [CAPC1608L]  (hidden comment: Cap2)
C61  value 0.1uF  [CAPC1608L]  (hidden comment: Cap2)
C62  value 0.1uF  [CAPC1608L]  (hidden comment: Cap2)
C63  value 6.8uF  [C2413]  (hidden comment: Cap Pol3)
C64  value 0.1uF  [CAPC1608L]  (hidden comment: Cap2)
C65  value 6.8uF  [C2413]  (hidden comment: Cap Pol3)
C100  value 10uF  [CAPC3216N]  (hidden comment: Cap Pol3)
D1  D Schottky  [PowerDI123]  (value not drawn)
D2  D Schottky  [PowerDI123]  (value not drawn)
J5  BNC  [AMP31-5540]
JP1  AIN  [HDR1X3]  (value not drawn)
JP5  AIN  [HDR1X3]  (value not drawn)
P1  Header 2  [HDR1X2]  (value not drawn)
P2  Header 5  [HDR1X5]
R37  value 0  [RESC1608N]  (hidden comment: Res3)
R38  value 10K  [RESC1608N]  (hidden comment: Res3)
R39  value 1K  [RESC1608N]  (hidden comment: Res3)
R40  value 12K  [RESC1608N]  (hidden comment: Res3)
R41  value 200  [RESC1608N]  (hidden comment: Res3)
R42  value 0  [RESC1608N]  (hidden comment: Res3)
R43  value 4.8K  [RESC1608N]  (hidden comment: Res3)
U16  ADS830  [DBQ20]
U17  THS4042  [D8]

### Nets
AGND: C57.2 C58.2 C59.2 C60.2 C61.2 C62.2 C63.2 C64.1 C65.1 C100.2 J5.2(SHIELD) P1.2 P2.5 R37.1 U16.1(GND) U16.18(GND) U17.5(2IN+)  [also labelled GND]
VCC33: C57.1 C58.1 C100.1 R38.1 U16.19(VS+) U16.20(VDRV)  [also labelled VCCA5]  [project net VCC]
VCC+12: C62.1 C63.1 D1.K P2.3 U17.8(VCC+)
VCC-12: C64.2 C65.2 D2.A P2.4 R43.1 U17.4(VCC-)
ACLK: U16.10(CLK)
SIG0: U16.9(BIT8)
SIG1: U16.8(BIT7)
SIG2: U16.7(BIT6)
SIG3: U16.6(BIT5)
SIG4: U16.5(BIT4)
SIG5: U16.4(BIT3)
SIG6: U16.3(BIT2)
SIG7: U16.2(BIT1)
NetC59_1: C59.1 U16.13(REFB)
NetC60_1: C60.1 U16.14(REFT)
NetC61_1: C61.1 JP5.2(J2) U16.15(CM)
NetD1_A: D1.A D2.K J5.1(SIGNAL) JP1.2(J2) P1.1
NetJP1_1: JP1.1(J1) R42.2
NetJP1_3: JP1.3(J3) JP5.3(J3) P2.1 U16.17(IN)
NetJP5_1: JP5.1(J1) P2.2 R39.2 U16.16(*IN) U17.7(2OUT)
NetR37_2: R37.2 U16.12(*INT/EXT)
NetR38_2: R38.2 U16.11(RSEL)
NetR39_1: R39.1 R40.1 R43.2 U17.6(2IN-)
NetR40_2: R40.2 R41.1 U17.1(1OUT)
NetR41_2: R41.2 U17.2(1IN-)
NetR42_1: R42.1 U17.3(1IN+)

### Library data of the parts
C57-C62 C64 = Cap2: Capacitor; Published: 23-Sep-2002; PackageReference: CAPR5-4X5; Publisher: Altium Limited; PackageDescription: Capacitor; 2 Leads
C63 C65 C100 = Cap Pol3: Polarized Capacitor (Surface Mount); Published: 8-Jun-2000; LatestRevisionDate: 29-May-2009; LatestRevisionNote: IPC-7351 Footprint Added.; PackageReference: C0805; Publisher: Altium Limited; PackageDescription: Chip Capacitor
D1 D2 = D Schottky: Schottky Diode; Published: 8-Jun-2000; LatestRevisionDate: 17-Jul-2002; LatestRevisionNote: Re-released for DXP Platform.; PackageReference: SMB; Publisher: Altium Limited; PackageDescription: DO-214-AA/SMB; 2 C-Bend Leads; Body 5.3 x 3.6 mm, inc. leads (LxW); Code_JEDEC: DO-214-AA
J5 = BNC: BNC Connector
JP1 JP5 = JUMPER3SM
P1 = Header 2: Header, 2-Pin; LatestRevisionDate: 17-Jul-2002; LatestRevisionNote: Re-released for DXP Platform.; Publisher: Altium Limited
P2 = Header 5: Header, 5-Pin; LatestRevisionDate: 17-Jul-2002; LatestRevisionNote: Re-released for DXP Platform.; Publisher: Altium Limited
R37-R43 = Res3: Resistor; Published: 8-Jun-2000; LatestRevisionDate: 29-May-2009; LatestRevisionNote: IPC-7351 Footprint Added.; PackageReference: J1-0603; Publisher: Altium Limited; PackageDescription: Chip Resistor
U16 = ADS830_DBQ_20: Imported; Manufacturer: Texas Instruments; INDUSTRY_STD_PKG_TYPE: SSOP/QSOP; FAMILY_NAME: HIGH SPEED ADC (>10MSPS); PIN_COUNT: 20; PACKAGE_DESIGNATOR: DBQ; Datasheet URL: http://www.ti.com/lit/gpn/ADS830; GENERIC_PART_NUMBER: ADS830; RefDes: RefDes; Type: DEV; Value: Value
U17 = THS4042_D_8: Imported; Vendor: Texas Instruments; PACKAGE_DESIGNATOR: D; PIN_COUNT: 8; FAMILY_NAME: VOLTAGE FEEDBACK; INDUSTRY_STD_PKG_TYPE: SOIC; Manufacturer_Part_Number: ths4042_d_8; GENERIC_PART_NUMBER: THS4042; Datasheet URL: http://www.ti.com/lit/gpn/THS4042; Manufacturer: Texas Instruments; RefDes: RefDes; Type: DEV; Value: Value

## Sheet user_input.SchDoc: SoPC Oscilloscope - User Interface
size A; DrawnBy: Santiago Navonne; Revision: 1.1; SheetNumber: 5; SheetTotal: 5
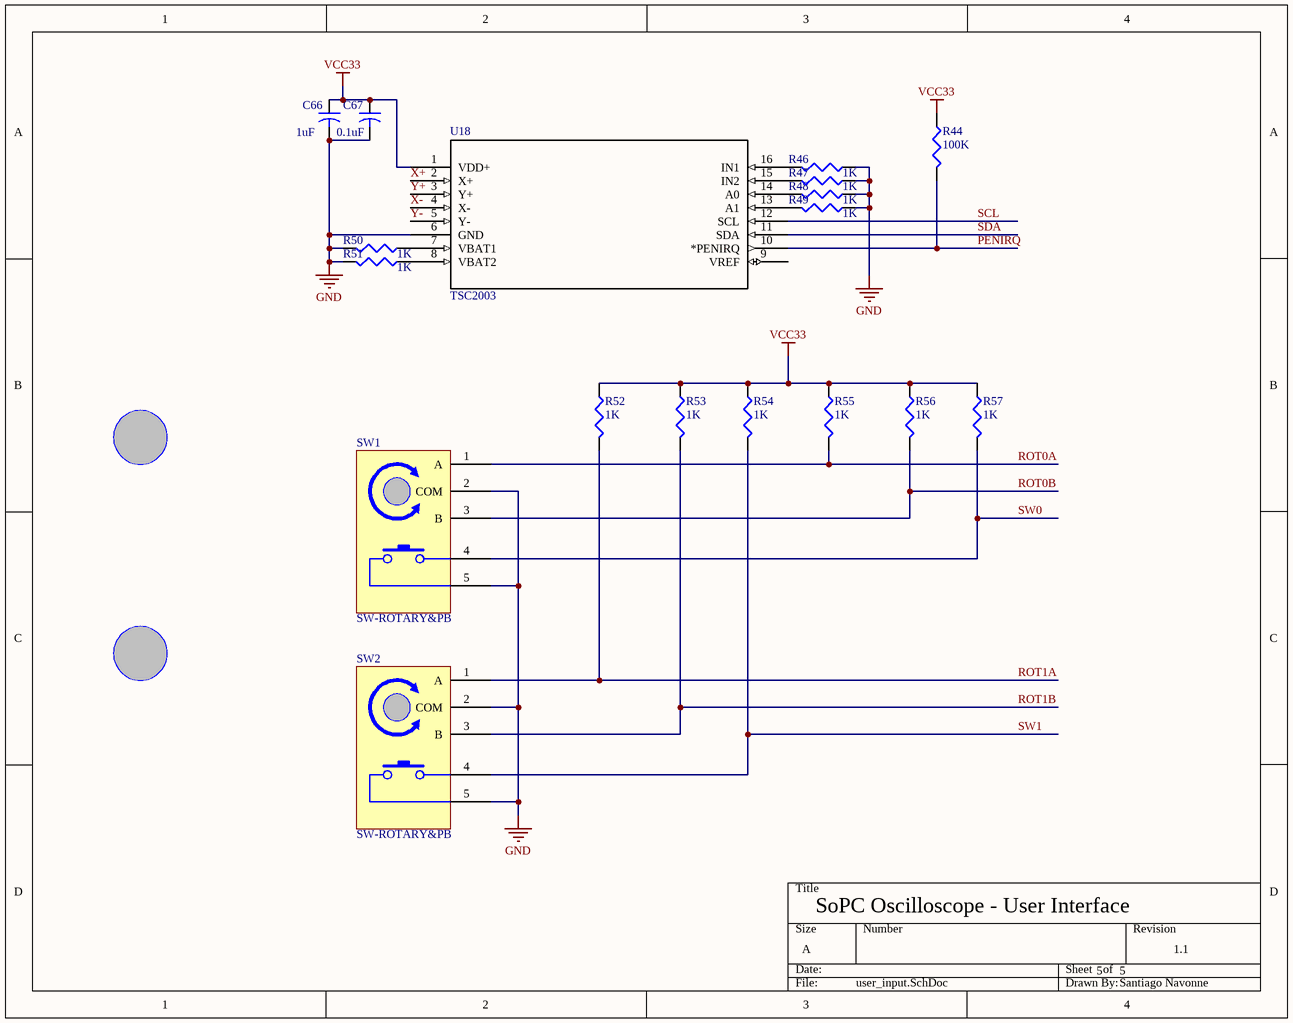
[diagram p4: user_input.SchDoc]

### Parts
C66  value 1uF  [CAPC1608L]  (hidden comment: Cap2)
C67  value 0.1uF  [CAPC1608L]  (hidden comment: Cap2)
R44  value 100K  [RESC1608N]  (hidden comment: Res3)
R46  value 1K  [RESC1608N]  (hidden comment: Res3)
R47  value 1K  [RESC1608N]  (hidden comment: Res3)
R48  value 1K  [RESC1608N]  (hidden comment: Res3)
R49  value 1K  [RESC1608N]  (hidden comment: Res3)
R50  value 1K  [RESC1608N]  (hidden comment: Res3)
R51  value 1K  [RESC1608N]  (hidden comment: Res3)
R52  value 1K  [RESC1608N]  (hidden comment: Res3)
R53  value 1K  [RESC1608N]  (hidden comment: Res3)
R54  value 1K  [RESC1608N]  (hidden comment: Res3)
R55  value 1K  [RESC1608N]  (hidden comment: Res3)
R56  value 1K  [RESC1608N]  (hidden comment: Res3)
R57  value 1K  [RESC1608N]  (hidden comment: Res3)
SW1  SW-ROTARY&PB  [PEC16-4xxxF-Sxxxx]
SW2  SW-ROTARY&PB  [PEC16-4xxxF-Sxxxx]
U18  TSC2003  [PW16]

### Nets
GND: C66.2 C67.2 R46.1 R47.1 R48.1 R49.1 R50.2 R51.2 SW1.2(COM) SW1.5 SW2.2(COM) SW2.5 U18.6(GND)  [project net AGND]
VCC33: C66.1 C67.1 R44.1 R52.1 R53.1 R54.1 R55.1 R56.1 R57.1 U18.1(VDD+)  [project net VCC]
PENIRQ: R44.2 U18.10(*PENIRQ)
ROT0A: R55.2 SW1.1(A)
ROT0B: R56.2 SW1.3(B)
ROT1A: R52.2 SW2.1(A)
ROT1B: R53.2 SW2.3(B)
SCL: U18.12(SCL)
SDA: U18.11(SDA)
SW0: R57.2 SW1.4
SW1: R54.2 SW2.4
X+: U18.2(X+)
X-: U18.4(X-)
Y+: U18.3(Y+)
Y-: U18.5(Y-)
NetR46_2: R46.2 U18.16(IN1)
NetR47_2: R47.2 U18.15(IN2)
NetR48_2: R48.2 U18.14(A0)
NetR49_2: R49.2 U18.13(A1)
NetR50_1: R50.1 U18.7(VBAT1)
NetR51_1: R51.1 U18.8(VBAT2)

Not connected (* = marked no-connect by the designer): U18 9(VREF)

### Library data of the parts
C66 C67 = Cap2: Capacitor; Published: 23-Sep-2002; PackageReference: CAPR5-4X5; Publisher: Altium Limited; PackageDescription: Capacitor; 2 Leads
R44 R46-R57 = Res3: Resistor; Published: 8-Jun-2000; LatestRevisionDate: 29-May-2009; LatestRevisionNote: IPC-7351 Footprint Added.; PackageReference: J1-0603; Publisher: Altium Limited; PackageDescription: Chip Resistor
SW1 SW2 = SW-ROTARY&PB: Rotary Encoder with Built-In Push Button
U18 = TSC2003_PW_16: Imported; Manufacturer: Texas Instruments; INDUSTRY_STD_PKG_TYPE: TSSOP; FAMILY_NAME: TOUCH SCREEN CONTROLLER; PIN_COUNT: 16; PACKAGE_DESIGNATOR: PW; Datasheet URL: http://www.ti.com/lit/gpn/TSC2003; GENERIC_PART_NUMBER: TSC2003; RefDes: RefDes; Type: DEV; Value: Value

## Sheet vram.SchDoc: SoPC Oscilloscope - VRAM, Display
size A; DrawnBy: Santiago Navonne; Revision: 1.1; SheetNumber: 4; SheetTotal: 5
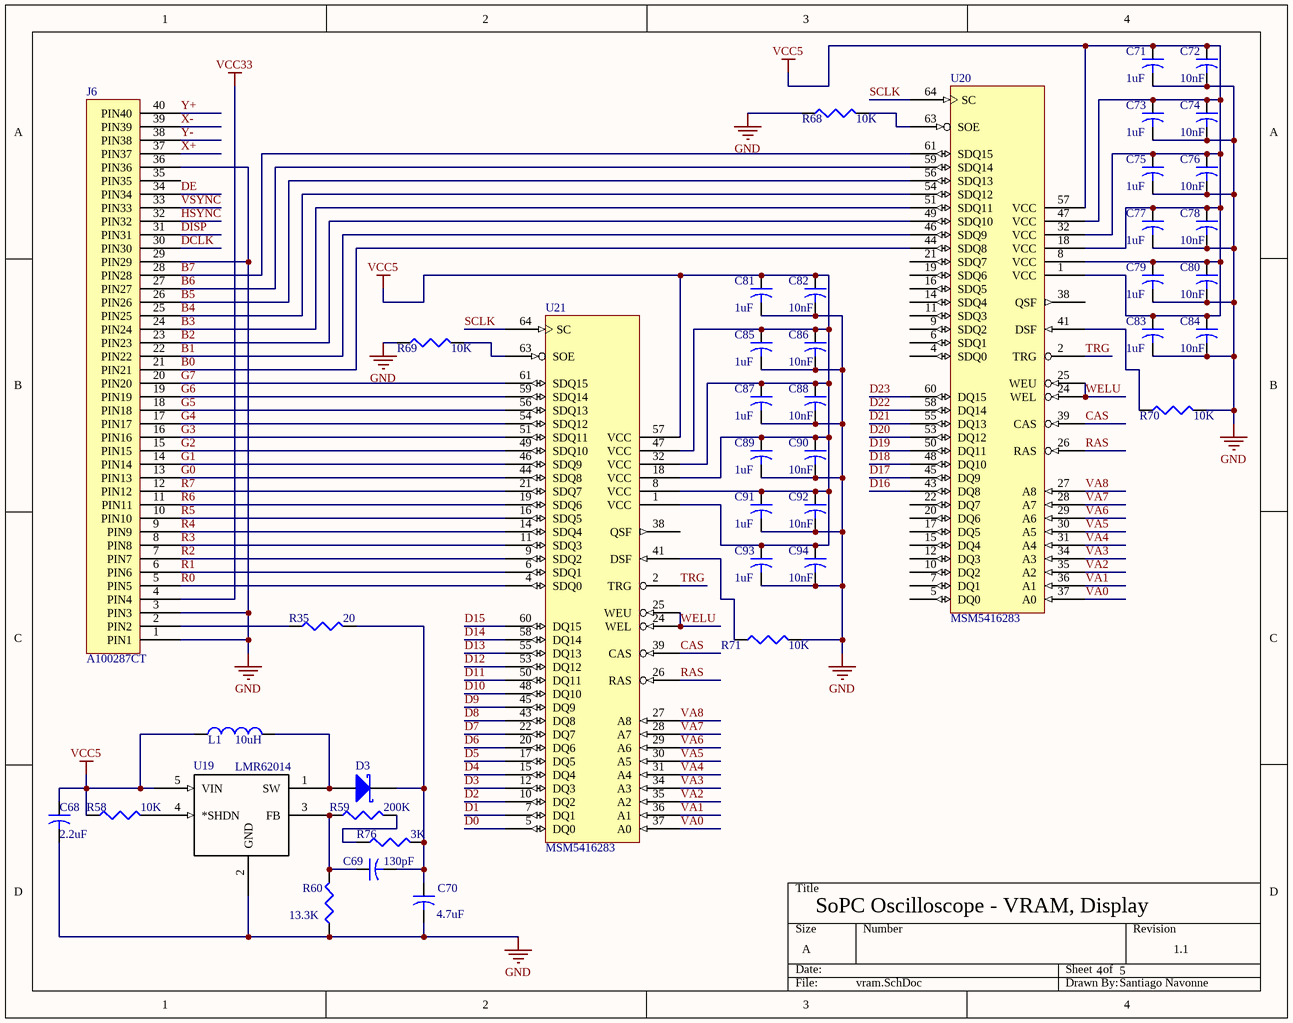
[diagram p5: vram.SchDoc]

### Parts
C68  value 2.2uF  [CAPC1608L]  (hidden comment: Cap2)
C69  value 130pF  [CAPC2012N]  (hidden comment: Cap2)
C70  value 4.7uF  [CAPC1608L]  (hidden comment: Cap2)
C71  value 1uF  [CAPC1608L]  (hidden comment: Cap2)
C72  value 10nF  [CAPC1608L]  (hidden comment: Cap2)
C73  value 1uF  [CAPC1608L]  (hidden comment: Cap2)
C74  value 10nF  [CAPC1608L]  (hidden comment: Cap2)
C75  value 1uF  [CAPC1608L]  (hidden comment: Cap2)
C76  value 10nF  [CAPC1608L]  (hidden comment: Cap2)
C77  value 1uF  [CAPC1608L]  (hidden comment: Cap2)
C78  value 10nF  [CAPC1608L]  (hidden comment: Cap2)
C79  value 1uF  [CAPC1608L]  (hidden comment: Cap2)
C80  value 10nF  [CAPC1608L]  (hidden comment: Cap2)
C81  value 1uF  [CAPC1608L]  (hidden comment: Cap2)
C82  value 10nF  [CAPC1608L]  (hidden comment: Cap2)
C83  value 1uF  [CAPC1608L]  (hidden comment: Cap2)
C84  value 10nF  [CAPC1608L]  (hidden comment: Cap2)
C85  value 1uF  [CAPC1608L]  (hidden comment: Cap2)
C86  value 10nF  [CAPC1608L]  (hidden comment: Cap2)
C87  value 1uF  [CAPC1608L]  (hidden comment: Cap2)
C88  value 10nF  [CAPC1608L]  (hidden comment: Cap2)
C89  value 1uF  [CAPC1608L]  (hidden comment: Cap2)
C90  value 10nF  [CAPC1608L]  (hidden comment: Cap2)
C91  value 1uF  [CAPC1608L]  (hidden comment: Cap2)
C92  value 10nF  [CAPC1608L]  (hidden comment: Cap2)
C93  value 1uF  [CAPC1608L]  (hidden comment: Cap2)
C94  value 10nF  [CAPC1608L]  (hidden comment: Cap2)
D3  D Schottky  [PowerDI123]  (value not drawn)
J6  A100287CT  [FPC40]
L1  value 10uH  [lsdr0703]  (hidden comment: Inductor)
R35  value 20  [RESC1608N]  (hidden comment: Res3)
R58  value 10K  [RESC1608N]  (hidden comment: Res3)
R59  value 200K  [RESC1608N]  (hidden comment: Res3)
R60  value 13.3K  [RESC1608N]  (hidden comment: Res3)
R68  value 10K  [RESC1608N]  (hidden comment: Res3)
R69  value 10K  [RESC1608N]  (hidden comment: Res3)
R70  value 10K  [RESC1608N]  (hidden comment: Res3)
R71  value 10K  [RESC1608N]  (hidden comment: Res3)
R76  value 3K  [RESC1608N]  (hidden comment: Res3)
U19  LMR62014  [MF05A]
U20  MSM5416283  [SSOP64]
U21  MSM5416283  [SSOP64]

### Nets
GND: C68.2 C70.2 C71.2 C72.2 C73.2 C74.2 C75.2 C76.2 C77.2 C78.2 C79.2 C80.2 C81.2 C82.2 C83.2 C84.2 C85.2 C86.2 C87.2 C88.2 C89.2 C90.2 C91.2 C92.2 C93.2 C94.2 J6.1(PIN1) J6.3(PIN3) J6.29(PIN29) J6.36(PIN36) R60.1 R68.1 R69.1 R70.2 R71.2 U19.2(GND) U20.3(GND) U20.13(GND) U20.23(GND) U20.33(GND) U20.42(GND) U20.52(GND) U20.62(GND) U21.3(GND) U21.13(GND) U21.23(GND) U21.33(GND) U21.42(GND) U21.52(GND) U21.62(GND)  [project net AGND]
VCC33: C68.1 C71.1 C72.1 C73.1 C74.1 C75.1 C76.1 C77.1 C78.1 C79.1 C80.1 C81.1 C82.1 C83.1 C84.1 C85.1 C86.1 C87.1 C88.1 C89.1 C90.1 C91.1 C92.1 C93.1 C94.1 J6.4(PIN4) L1.1 R58.1 U19.5(VIN) U20.1(VCC) U20.8(VCC) U20.18(VCC) U20.32(VCC) U20.47(VCC) U20.57(VCC) U21.1(VCC) U21.8(VCC) U21.18(VCC) U21.32(VCC) U21.47(VCC) U21.57(VCC)  [also labelled VCC5]  [project net VCC]
B0: J6.21(PIN21) U20.44(SDQ8)
B1: J6.22(PIN22) U20.46(SDQ9)
B2: J6.23(PIN23) U20.49(SDQ10)
B3: J6.24(PIN24) U20.51(SDQ11)
B4: J6.25(PIN25) U20.54(SDQ12)
B5: J6.26(PIN26) U20.56(SDQ13)
B6: J6.27(PIN27) U20.59(SDQ14)
B7: J6.28(PIN28) U20.61(SDQ15)
CAS: U20.39(CAS) U21.39(CAS)
D0: U21.5(DQ0)
D1: U21.7(DQ1)
D2: U21.10(DQ2)
D3: U21.12(DQ3)
D4: U21.15(DQ4)
D5: U21.17(DQ5)
D6: U21.20(DQ6)
D7: U21.22(DQ7)
D8: U21.43(DQ8)
D9: U21.45(DQ9)
D10: U21.48(DQ10)
D11: U21.50(DQ11)
D12: U21.53(DQ12)
D13: U21.55(DQ13)
D14: U21.58(DQ14)
D15: U21.60(DQ15)
D16: U20.43(DQ8)
D17: U20.45(DQ9)
D18: U20.48(DQ10)
D19: U20.50(DQ11)
D20: U20.53(DQ12)
D21: U20.55(DQ13)
D22: U20.58(DQ14)
D23: U20.60(DQ15)
DCLK: J6.30(PIN30)
DE: J6.34(PIN34)
DISP: J6.31(PIN31)
G0: J6.13(PIN13) U21.44(SDQ8)
G1: J6.14(PIN14) U21.46(SDQ9)
G2: J6.15(PIN15) U21.49(SDQ10)
G3: J6.16(PIN16) U21.51(SDQ11)
G4: J6.17(PIN17) U21.54(SDQ12)
G5: J6.18(PIN18) U21.56(SDQ13)
G6: J6.19(PIN19) U21.59(SDQ14)
G7: J6.20(PIN20) U21.61(SDQ15)
HSYNC: J6.32(PIN32)
R0: J6.5(PIN5) U21.4(SDQ0)
R1: J6.6(PIN6) U21.6(SDQ1)
R2: J6.7(PIN7) U21.9(SDQ2)
R3: J6.8(PIN8) U21.11(SDQ3)
R4: J6.9(PIN9) U21.14(SDQ4)
R5: J6.10(PIN10) U21.16(SDQ5)
R6: J6.11(PIN11) U21.19(SDQ6)
R7: J6.12(PIN12) U21.21(SDQ7)
RAS: U20.26(RAS) U21.26(RAS)
SCLK: U20.64(SC) U21.64(SC)
TRG: U20.2(TRG) U21.2(TRG)
VA0: U20.37(A0) U21.37(A0)
VA1: U20.36(A1) U21.36(A1)
VA2: U20.35(A2) U21.35(A2)
VA3: U20.34(A3) U21.34(A3)
VA4: U20.31(A4) U21.31(A4)
VA5: U20.30(A5) U21.30(A5)
VA6: U20.29(A6) U21.29(A6)
VA7: U20.28(A7) U21.28(A7)
VA8: U20.27(A8) U21.27(A8)
VSYNC: J6.33(PIN33)
WELU: U20.24(WEL) U20.25(WEU) U21.24(WEL) U21.25(WEU)
X+: J6.37(PIN37)
X-: J6.39(PIN39)
Y+: J6.40(PIN40)
Y-: J6.38(PIN38)
NetC69_1: C69.1 R59.1 R60.2 U19.3(FB)
NetC69_2: C69.2 C70.1 D3.K R35.2 R76.2
NetD3_A: D3.A L1.2 U19.1(SW)
NetJ6_2: J6.2(PIN2) R35.1
NetR58_2: R58.2 U19.4(*SHDN)
NetR59_2: R59.2 R76.1
NetR68_2: R68.2 U20.63(SOE)
NetR69_2: R69.2 U21.63(SOE)
NetR70_1: R70.1 U20.41(DSF)
NetR71_1: R71.1 U21.41(DSF)

Not connected (* = marked no-connect by the designer): J6 35(PIN35); U20 4(SDQ0) 5(DQ0) 6(SDQ1) 7(DQ1) 9(SDQ2) 10(DQ2) 11(SDQ3) 12(DQ3) 14(SDQ4) 15(DQ4) 16(SDQ5) 17(DQ5) 19(SDQ6) 20(DQ6) 21(SDQ7) 22(DQ7) 38(QSF); U21 38(QSF)

### Library data of the parts
C68-C94 = Cap2: Capacitor; Published: 23-Sep-2002; PackageReference: CAPR5-4X5; Publisher: Altium Limited; PackageDescription: Capacitor; 2 Leads
D3 = D Schottky: Schottky Diode; Published: 8-Jun-2000; LatestRevisionDate: 17-Jul-2002; LatestRevisionNote: Re-released for DXP Platform.; PackageReference: SMB; Publisher: Altium Limited; PackageDescription: DO-214-AA/SMB; 2 C-Bend Leads; Body 5.3 x 3.6 mm, inc. leads (LxW); Code_JEDEC: DO-214-AA
L1 = Inductor: Code_IEC: 1005; Published: 8-Jun-2000; LatestRevisionDate: 29-May-2009; LatestRevisionNote: IPC-7351 Footprint Added.; PackageReference: 0402-A; Publisher: Altium Limited; PackageDescription: Chip Inductor; Code_JEITA: 0402
R35 R58-R60 R68-R71 R76 = Res3: Resistor; Published: 8-Jun-2000; LatestRevisionDate: 29-May-2009; LatestRevisionNote: IPC-7351 Footprint Added.; PackageReference: J1-0603; Publisher: Altium Limited; PackageDescription: Chip Resistor
U19 = LMR62014_DBV_5: Imported; Manufacturer: Texas Instruments; DatasheetURL: http://www.ti.com/lit/ds/symlink/lmr62014.pdf; basePN: LMR62014; NSC_PackageReference: MF05A; Manufacturer_Part_Number: lmr62014_dbv_5; Vendor: Texas Instruments; RefDes: RefDes; Type: DEV; Value: Value
U20 U21 = MSM5416283: 262,144-Word x 16-Bit Multiport DRAM

## Nets that join several sheets
AGND: fpga_sch (212 pins), sram_rom (6 pins), analog_frontend (17 pins), user_input (13 pins), vram (50 pins)
VCC: fpga_sch (101 pins), sram_rom (6 pins), analog_frontend (6 pins), user_input (10 pins), vram (41 pins)
VCC+12: fpga_sch (C98.1 J4.4), analog_frontend (5 pins)
VCC-12: fpga_sch (C99.2 J4.2), analog_frontend (6 pins)
A0: fpga_sch (U8.47), sram_rom (U14.12 U15.31)
A1: fpga_sch (U8.46), sram_rom (U14.11 U15.2)
A2: fpga_sch (U8.44), sram_rom (U14.10 U15.3)
A3: fpga_sch (U8.43), sram_rom (U14.9 U15.4)
A4: fpga_sch (U8.41), sram_rom (U14.8 U15.28)
A5: fpga_sch (U8.40), sram_rom (U14.7 U15.5)
A6: fpga_sch (U8.38), sram_rom (U14.6 U15.27)
A7: fpga_sch (U8.37), sram_rom (U14.5 U15.6)
A8: fpga_sch (U8.36), sram_rom (U14.27 U15.26)
A9: fpga_sch (U8.35), sram_rom (U14.26 U15.7)
A10: fpga_sch (U8.33), sram_rom (U14.23 U15.25)
A11: fpga_sch (U8.32), sram_rom (U14.25 U15.8)
A12: fpga_sch (U8.30), sram_rom (U14.4 U15.9)
A13: fpga_sch (U8.29), sram_rom (U14.28 U15.23)
A14: fpga_sch (U8.27), sram_rom (U14.29 U15.10)
A15: fpga_sch (U8.26), sram_rom (U14.3 U15.11)
A16: fpga_sch (U9.47), sram_rom (U14.2 U15.12)
A17: fpga_sch (U9.46), sram_rom (U14.30)
A18: fpga_sch (U9.44), sram_rom (U14.1)
ACLK: fpga_sch (U7.37), analog_frontend (U16.10)
CAS: fpga_sch (U1.33), vram (U20.39 U21.39)
CS0: fpga_sch (U9.41), sram_rom (U14.22)
CS1: fpga_sch (U9.40), sram_rom (U15.22)
D0: fpga_sch (U9.36), sram_rom (U14.13 U15.21), vram (U21.5)
D1: fpga_sch (U9.35), sram_rom (U14.14 U15.13), vram (U21.7)
D2: fpga_sch (U9.33), sram_rom (U14.15 U15.20), vram (U21.10)
D3: fpga_sch (U9.32), sram_rom (U14.17 U15.14), vram (U21.12)
D4: fpga_sch (U9.30), sram_rom (U14.18 U15.19), vram (U21.15)
D5: fpga_sch (U9.29), sram_rom (U14.19 U15.15), vram (U21.17)
D6: fpga_sch (U9.27), sram_rom (U14.20 U15.18), vram (U21.20)
D7: fpga_sch (U9.26), sram_rom (U14.21 U15.17), vram (U21.22)
D8: fpga_sch (U6.26), vram (U21.43)
D9: fpga_sch (U6.27), vram (U21.45)
D10: fpga_sch (U6.29), vram (U21.48)
D11: fpga_sch (U6.30), vram (U21.50)
D12: fpga_sch (U6.32), vram (U21.53)
D13: fpga_sch (U6.33), vram (U21.55)
D14: fpga_sch (U6.35), vram (U21.58)
D15: fpga_sch (U6.36), vram (U21.60)
D16: fpga_sch (U6.37), vram (U20.43)
D17: fpga_sch (U6.38), vram (U20.45)
D18: fpga_sch (U6.40), vram (U20.48)
D19: fpga_sch (U6.41), vram (U20.50)
D20: fpga_sch (U6.43), vram (U20.53)
D21: fpga_sch (U6.44), vram (U20.55)
D22: fpga_sch (U6.46), vram (U20.58)
D23: fpga_sch (U6.47), vram (U20.60)
DCLK: fpga_sch (U1.27), vram (J6.30)
DISP: fpga_sch (U1.26), vram (J6.31)
HSYNC: fpga_sch (U7.47), vram (J6.32)
PENIRQ: fpga_sch (U7.35), user_input (R44.2 U18.10)
RAS: fpga_sch (U1.35), vram (U20.26 U21.26)
ROT0A: fpga_sch (U7.29), user_input (R55.2 SW1.1)
ROT0B: fpga_sch (U7.30), user_input (R56.2 SW1.3)
ROT1A: fpga_sch (U7.32), user_input (R52.2 SW2.1)
ROT1B: fpga_sch (U7.33), user_input (R53.2 SW2.3)
SCL: fpga_sch (R1.2 U2.100), user_input (U18.12)
SCLK: fpga_sch (U1.30), vram (U20.64 U21.64)
SDA: fpga_sch (R2.2 U2.103), user_input (U18.11)
SIG0: fpga_sch (U3.26), analog_frontend (U16.9)
SIG1: fpga_sch (U3.27), analog_frontend (U16.8)
SIG2: fpga_sch (U3.29), analog_frontend (U16.7)
SIG3: fpga_sch (U3.30), analog_frontend (U16.6)
SIG4: fpga_sch (U3.32), analog_frontend (U16.5)
SIG5: fpga_sch (U3.33), analog_frontend (U16.4)
SIG6: fpga_sch (U3.35), analog_frontend (U16.3)
SIG7: fpga_sch (U3.36), analog_frontend (U16.2)
SW0: fpga_sch (U7.27), user_input (R57.2 SW1.4)
SW1: fpga_sch (U7.26), user_input (R54.2 SW2.4)
TRG: fpga_sch (U1.29), vram (U20.2 U21.2)
VA0: fpga_sch (U1.37), vram (U20.37 U21.37)
VA1: fpga_sch (U1.40), vram (U20.36 U21.36)
VA2: fpga_sch (U1.44), vram (U20.35 U21.35)
VA3: fpga_sch (U1.47), vram (U20.34 U21.34)
VA4: fpga_sch (U1.46), vram (U20.31 U21.31)
VA5: fpga_sch (U1.43), vram (U20.30 U21.30)
VA6: fpga_sch (U1.41), vram (U20.29 U21.29)
VA7: fpga_sch (U1.38), vram (U20.28 U21.28)
VA8: fpga_sch (U1.36), vram (U20.27 U21.27)
VSYNC: fpga_sch (U7.46), vram (J6.33)
WELU: fpga_sch (U1.32), vram (U20.24 U20.25 U21.24 U21.25)
WR: fpga_sch (U9.37), sram_rom (U15.29)
X+: user_input (U18.2), vram (J6.37)
X-: user_input (U18.4), vram (J6.39)
Y+: user_input (U18.3), vram (J6.40)
Y-: user_input (U18.5), vram (J6.38)